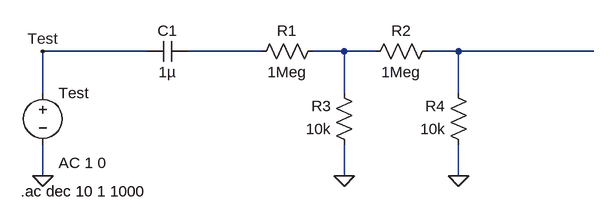
[diagram p0: schematic singal_input_z.asc]
singal_input_z.asc, the LTspice schematic file:
Version 4
SHEET 1 1444 680
WIRE -16 -96 -176 -96
WIRE 160 -96 48 -96
WIRE 288 -96 240 -96
WIRE 336 -96 288 -96
WIRE 464 -96 416 -96
WIRE 672 -96 464 -96
WIRE -176 -32 -176 -96
WIRE 288 -32 288 -96
WIRE 464 -32 464 -96
WIRE -176 96 -176 48
WIRE 288 96 288 48
WIRE 464 96 464 48
FLAG -176 96 0
FLAG 288 96 0
FLAG 464 96 0
FLAG -176 -96 Test
SYMBOL voltage -176 -48 R0
WINDOW 123 24 124 Left 2
WINDOW 39 0 0 Left 0
SYMATTR InstName Test
SYMATTR Value ""
SYMATTR Value2 AC 1 0
SYMBOL res 256 -112 R90
WINDOW 0 0 56 VBottom 2
WINDOW 3 32 56 VTop 2
SYMATTR InstName R1
SYMATTR Value 1Meg
SYMBOL res 432 -112 R90
WINDOW 0 0 56 VBottom 2
WINDOW 3 32 56 VTop 2
SYMATTR InstName R2
SYMATTR Value 1Meg
SYMBOL res 304 64 R180
WINDOW 0 36 76 Left 2
WINDOW 3 36 40 Left 2
SYMATTR InstName R3
SYMATTR Value 10k
SYMBOL res 480 64 R180
WINDOW 0 36 76 Left 2
WINDOW 3 36 40 Left 2
SYMATTR InstName R4
SYMATTR Value 10k
SYMBOL cap 48 -112 R90
WINDOW 0 0 32 VBottom 2
WINDOW 3 32 32 VTop 2
SYMATTR InstName C1
SYMATTR Value 1µ
TEXT -210 120 Left 2 !.ac dec 10 1 1000

The netlist it stands for:
* singal_input_z.asc
V§Test Test 0 AC 1 0
R1 N002 N001 1Meg
R2 N003 N002 1Meg
R3 0 N002 10k
R4 0 N003 10k
C1 N001 Test 1µ
.ac dec 10 1 1000
.backanno
.end